# EAGLE design ThroughHoleModule-compact (EAGLE 7.7.0)
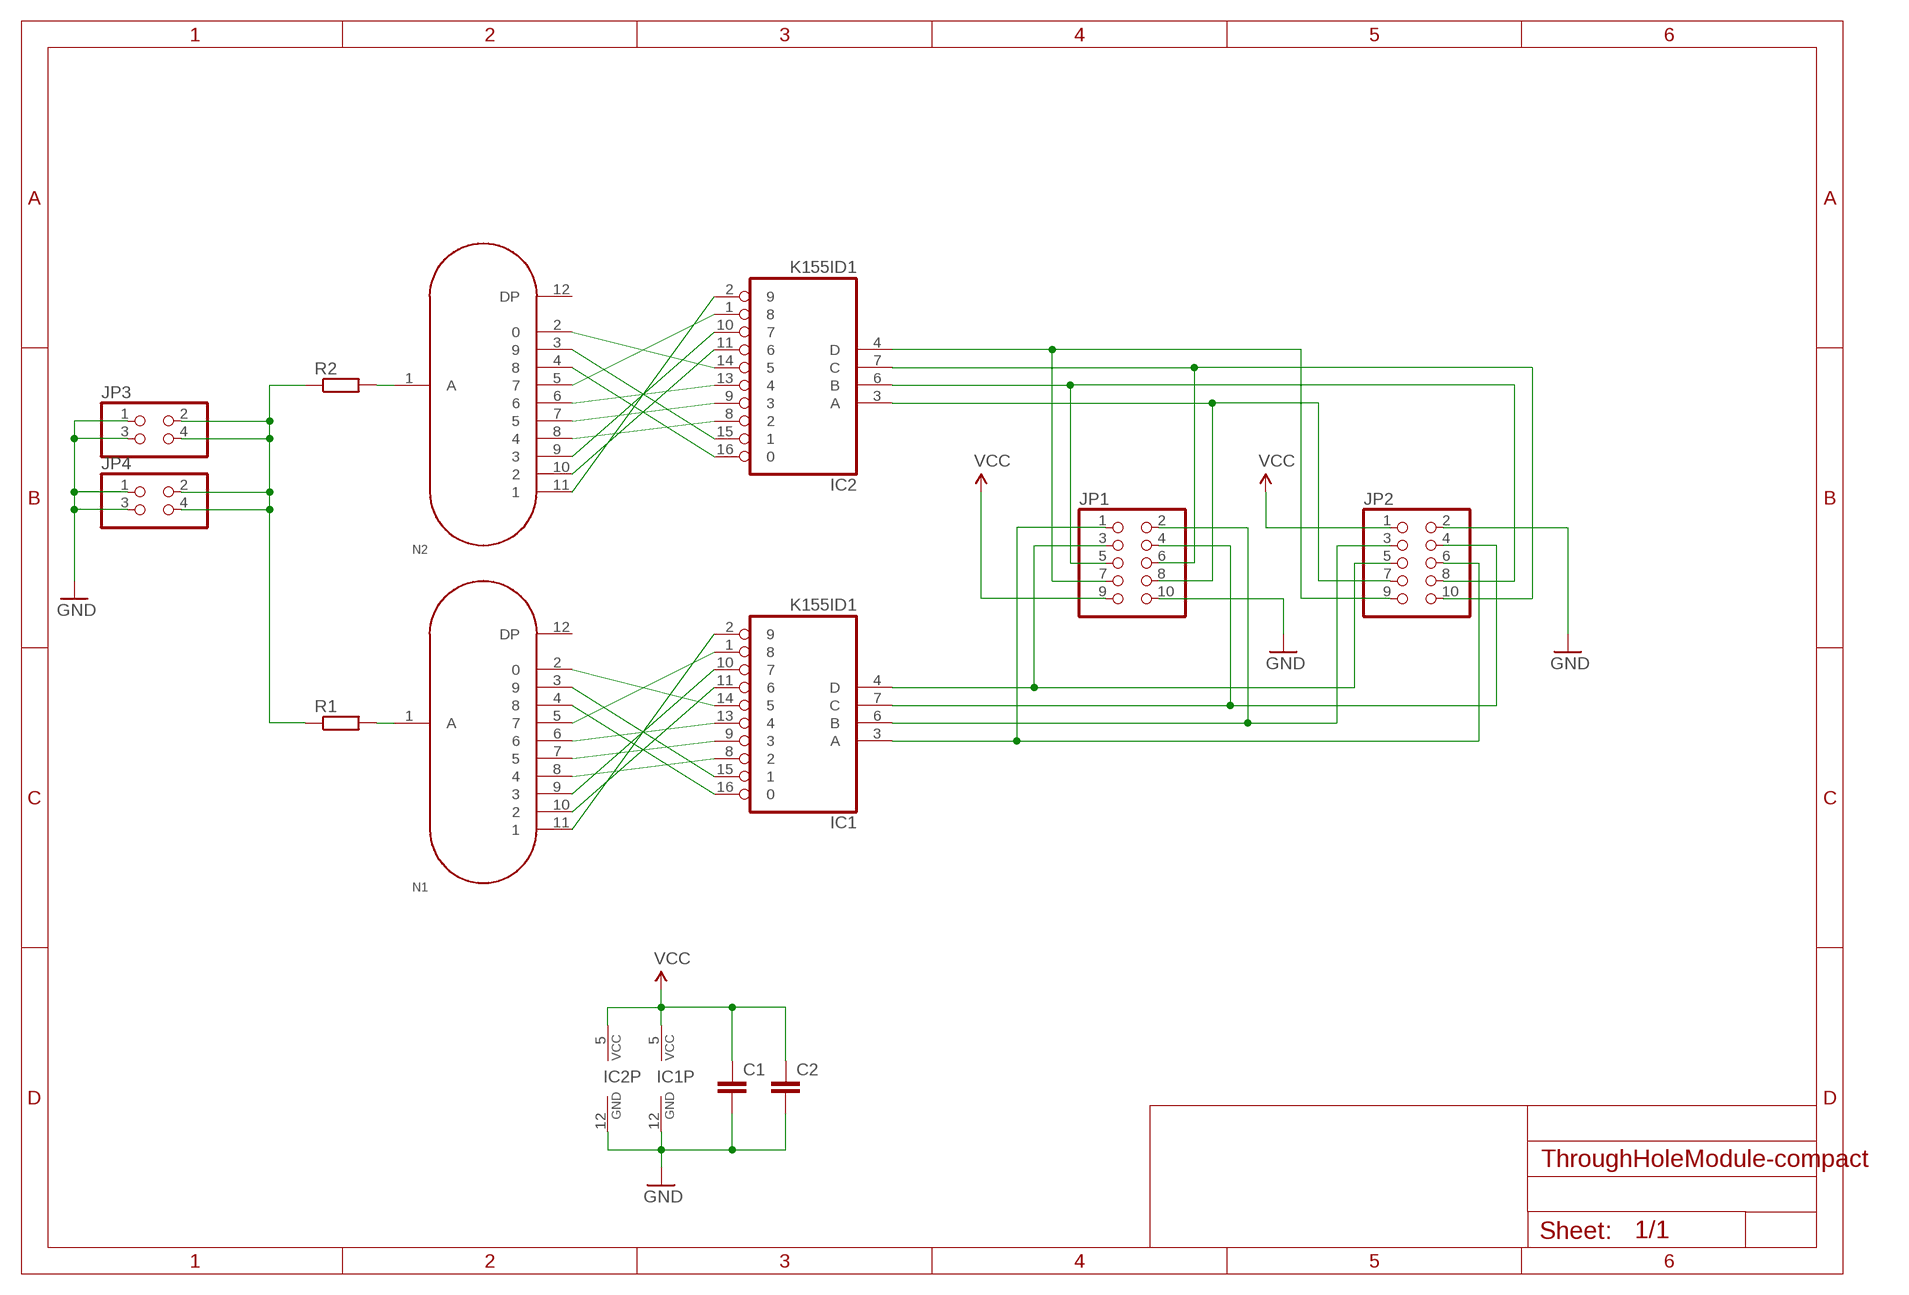
[diagram p0: schematic, sheet 1]

## Parts
C1  C-EU050-030X075  [C050-030X075]
C2  C-EU050-030X075  [C050-030X075]
IC1  K155ID1  74141N  [DIL16]
IC2  K155ID1  74141N  [DIL16]
JP1  PINHD-2X5  [2X05]
JP2  PINHD-2X5  [2X05]
JP3  PINHD-2X2  [2X02]
JP4  PINHD-2X2  [2X02]
N1  IN-12B  [IN-12]
N2  IN-12B  [IN-12]
R1  R-EU_0207/10  [0207/10]
R2  R-EU_0207/10  [0207/10]

## Nets
1A: IC1.3(A) JP1.1 JP2.6
1B: IC1.6(B) JP1.2 JP2.3
1C: IC1.7(C) JP1.4 JP2.4
1D: IC1.4(D) JP1.3 JP2.5
2A: IC2.3(A) JP1.8 JP2.7
2B: IC2.6(B) JP1.5 JP2.8
2C: IC2.7(C) JP1.6 JP2.10
2D: IC2.4(D) JP1.7 JP2.9
GND: C1.2 C2.2 IC1.12(GND) IC2.12(GND) JP1.10 JP2.2 JP3.1 JP3.3 JP4.1 JP4.3
HV [HighVoltage]: JP3.2 JP3.4 JP4.2 JP4.4 R1.1 R2.1
N$1: IC2.1 N2.5
N$2: IC2.13 N2.6
N$3: IC1.1 N1.5
N$4: IC1.13 N1.6
N$9: IC2.9 N2.7
N$10: IC2.8 N2.8
N$11: IC2.10 N2.9
N$12: IC2.11 N2.10
N$13: IC2.2 N2.11
N$16: IC2.14 N2.2
N$17: IC2.15 N2.3
N$18: IC2.16 N2.4
N$19: IC1.2 N1.11
N$20: IC1.11 N1.10
N$21: IC1.10 N1.9
N$22: IC1.8 N1.8
N$23: IC1.9 N1.7
N$26: IC1.16 N1.4
N$27: IC1.15 N1.3
N$28: IC1.14 N1.2
N$29 [HighVoltage]: N1.1(A) R1.2
N$30 [HighVoltage]: N2.1(A) R2.2
VCC: C1.1 C2.1 IC1.5(VCC) IC2.5(VCC) JP1.9 JP2.1
Unconnected: N1.12(DP) N2.12(DP)

## Library data of the parts
C1 C2 = rcl:C-EU: CAPACITOR, European symbol
IC1 IC2 = 74xx-eu:74*141: BCD to decimal DECODER/DRIVER
JP1 JP2 = pinhead:PINHD-2X5: PIN HEADER
JP3 JP4 = pinhead:PINHD-2X2: PIN HEADER
N1 N2 = ThroughHoleModule-compact:IN-12B
R1 R2 = rcl:R-EU_: RESISTOR, European symbol

## Net classes
1 HighVoltage: width 0.051 mm, clearance 0.305 mm

## Board
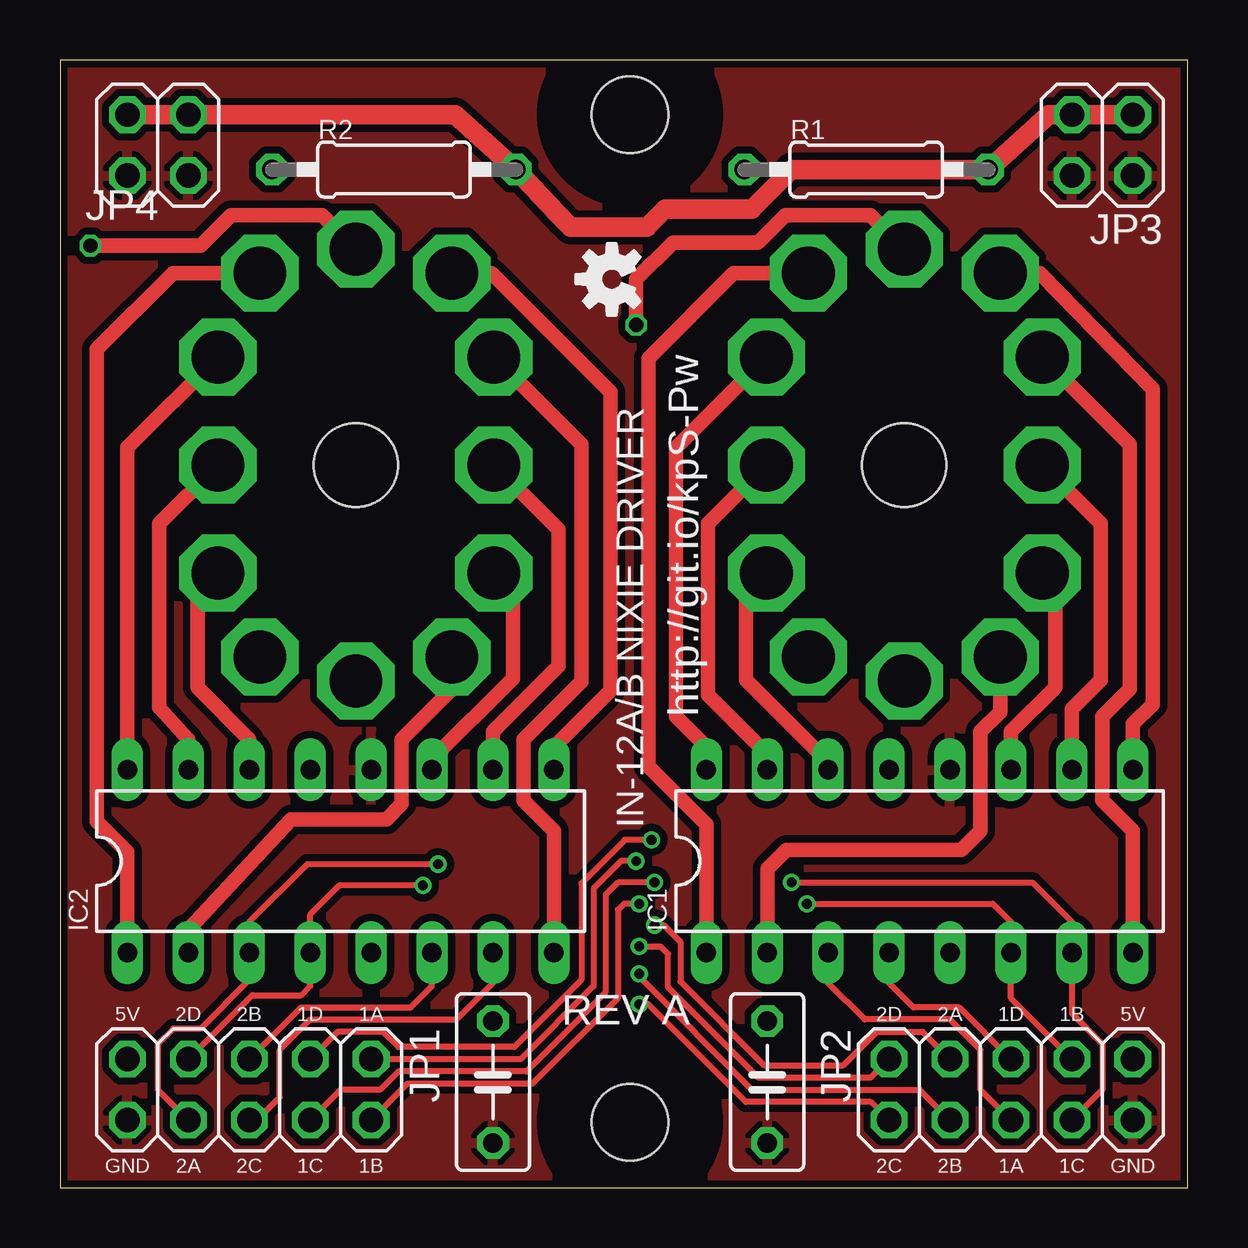
[diagram p1: board, top side]
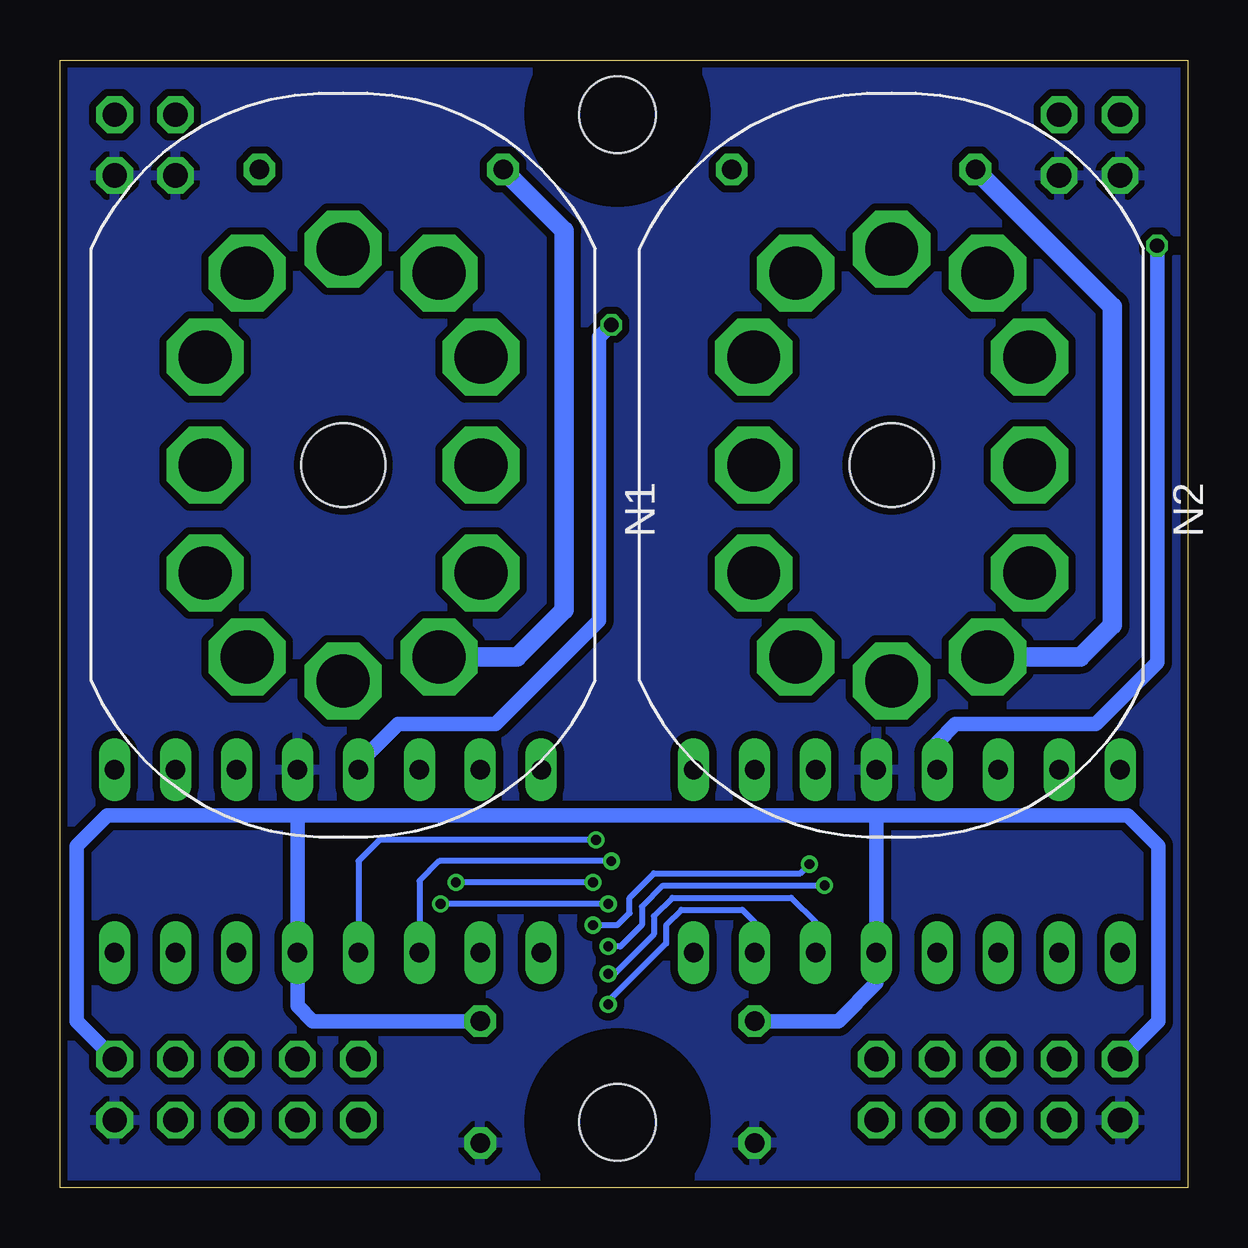
[diagram p2: board, bottom side, seen from below]

Size 47 x 47 mm. Coordinates in mm from the lower left corner, seen from the top.
Outline: 0,0 47,0 47,47 0,47 0,0
Copper layers (1*16): Top 0.035mm / dielectric 1.5mm / Bottom 0.035mm
Design rules "dirt_cheap_dirty_boards.v1.1": minimum track width 5mil, minimum drill 12mil, track to track 5mil, track to pad 5mil, pad to pad 5mil, via to via 5mil, smd to smd 0mil, copper to edge 10mil, drill to drill 10mil, minimum pad ring 10mil, minimum via ring 6mil, stop-mask expansion 2mil, vias tented up to drill 25mil, thermal gap 10mil
Holes 3.2 mm at 23.77,44.72 23.77,2.72
tRestrict: area 20.6,41.6 to 26.9,47.9; area 20.6,-0.4 to 26.9,5.9
bRestrict: area 20.6,41.6 to 26.9,47.9; area 20.6,-0.4 to 26.9,5.9

### Footprints (pad centres in the part's own frame; a part is rotated, then mirrored left to right if it is on the bottom)
C050-030X075 = drill 0.813 octagon: 1 -2.54,0; 2 2.54,0
DIL16 = drill 0.813 long: 1 -8.89,-3.81; 2 -6.35,-3.81; 3 -3.81,-3.81; 4 -1.27,-3.81; 5 1.27,-3.81; 6 3.81,-3.81; 7 6.35,-3.81; 8 8.89,-3.81; 9 8.89,3.81; 10 6.35,3.81; 11 3.81,3.81; 12 1.27,3.81; 13 -1.27,3.81; 14 -3.81,3.81; 15 -6.35,3.81; 16 -8.89,3.81
2X05 = drill 1.016 octagon: 1 -5.08,-1.27; 2 -5.08,1.27; 3 -2.54,-1.27; 4 -2.54,1.27; 5 0,-1.27; 6 0,1.27; 7 2.54,-1.27; 8 2.54,1.27; 9 5.08,-1.27; 10 5.08,1.27
2X02 = drill 1.016 octagon: 1 -1.27,-1.27; 2 -1.27,1.27; 3 1.27,-1.27; 4 1.27,1.27
IN-12 = drill 2.2 pad 3.1 octagon: 1 4,-8 | drill 2.2 octagon: 2 5.75,-4.5; 3 5.75,0; 4 5.75,4.5; 5 4,8; 6 0,9; 7 -4,8; 8 -5.75,4.5; 9 -5.75,0; 10 -5.75,-4.5; 11 -4,-8; 12 0,-9 | hole 3.5: 0,0
0207/10 = drill 0.813 octagon: 1 -5.08,0; 2 5.08,0

### Placement (x,y rotation side)
C1  29.48,4.4 270 top
C2  18.05,4.4 270 top
IC1  35.83,13.61 0 top
IC2  11.7,13.61 0 top
JP1  7.89,4.08 180 top
JP2  39.64,4.08 180 top
JP3  43.45,43.45 0 top
JP4  4.08,43.45 0 top
N1  35.2,30.11 0 bottom
N2  12.34,30.11 0 bottom
R1  33.61,42.43 180 top
R2  13.92,42.43 180 top
U$1  [OSHW-LOGO-S]  23,37.86 90 top

### Tracks (layer width: path | path; a pad name or v marks a point on that pad's centre or on a via)
1A  (via drill 0.41)
  Top 0.254: JP2.6 38.37,4.08 38.37,5.73 37.1,7 33.54,7 32.02,8.53 IC1.3 | v24.02,13.61 23.38,13.61 22.24,12.46 22.24,8.4 19.19,5.35 JP1.1
  Bottom 0.254: IC1.3 32.02,12.78 31.19,13.61 v24.02,13.61
1B  (via drill 0.41)
  Top 0.254: JP2.3 39.64,7.89 IC1.6 39.64,11.06 38.88,11.83 v31.13,11.83 | v24.15,11.83 23.51,11.83 23.26,11.57 23.26,7.89 19.7,4.33 14.49,4.33 JP1.2
  Bottom 0.254: v24.15,11.83 v31.13,11.83
1C  (via drill 0.41)
  Top 0.254: JP2.4 43.45,4.08 43.45,5.99 42.18,7.26 IC1.7 42.18,11.06 40.53,12.72 v30.5,12.72 | v24.78,12.72 23.26,12.72 22.75,12.21 22.75,8.14 19.45,4.84 14.11,4.84 13.35,4.08 11.7,4.08 JP1.4
  Bottom 0.254: v24.78,12.72 v30.5,12.72
1D  (via drill 0.41)
  Top 0.254: IC1.4 34.56,8.53 35.58,7.51 37.48,7.51 JP2.5 | v24.65,14.49 23.54,14.49 21.73,12.68 21.73,8.65 18.94,5.86 14.11,5.86 13.48,6.49 11.57,6.49 JP1.3
  Bottom 0.254: IC1.4 34.56,13.61 33.67,14.49 v24.65,14.49
2A  (via drill 0.41)
  Top 0.254: JP1.8 4.08,4.08 4.08,5.99 4.71,6.62 5.86,6.62 7.89,8.65 IC2.3 7.89,11.06 10.3,13.48 v15.76,13.48 | v24.78,10.94 25.16,10.94 25.86,10.24 25.86,8.59 29.35,5.1 32.66,5.1 34.05,6.49 35.96,6.49 JP2.7
  Bottom 0.254: v15.76,13.48 16.14,13.1 22.24,13.1 23.26,12.08 23.26,11.45 23.77,10.94 v24.78,10.94
2B  (via drill 0.41)
  Top 0.254: JP2.8 35.83,4.08 28.84,4.08 24.15,8.78 v24.15,8.91 | JP1.5 10.05,7.51 14.62,7.51 15.51,8.4 IC2.6
  Bottom 0.254: IC2.6 15.51,11.06 16.53,12.08 21.48,12.08 22.24,11.32 22.24,10.56 23.89,8.91 v24.15,8.91
2C  (via drill 0.41)
  Top 0.254: JP1.6 8.21,2.81 9.16,3.76 9.16,5.73 10.43,7 16.53,7 18.05,8.53 IC2.7 | v24.15,7.64 24.53,7.64 28.59,3.57 33.8,3.57 JP2.10
  Bottom 0.254: IC2.7 18.05,11.06 18.56,11.57 21.1,11.57 21.73,10.94 21.73,10.18 24.15,7.76 v24.15,7.64
2D  (via drill 0.41)
  Top 0.254: JP1.7 8.02,8.02 10.05,8.02 10.43,8.4 IC2.4 10.43,11.38 11.64,12.59 v15.13,12.59 | 34.24,5.03 JP2.9 33.8,4.59 29.1,4.59 25.35,8.34 25.35,9.73 25.04,10.05 v24.15,10.05
  Bottom 0.254: v15.13,12.59 21.86,12.59 22.75,11.7 22.75,10.94 23.64,10.05 v24.15,10.05
GND
  pour Top (isolate 0.305): 48.53,-1 -1,-1 -1,48.53 48.53,48.53
  pour Bottom (isolate 0.305): -1,-1 -1,48.53 48.53,48.53 48.53,-1
HV
  Top 0.813: JP3.4 JP3.2 41.23,44.72 R1.1 30.5,42.43 28.84,40.78 25.23,40.78 24.46,40.02 21.29,40.02 21.1,40.21 R2.1 16.46,44.72 JP4.4 JP4.2
N$1
  Top 0.61: IC2.1 2.81,13.99 1.54,15.26 1.54,34.94 4.71,38.12 N2.5
N$2  (via drill 0.6)
  Top 0.61: v1.27,39.26 5.86,39.26 7.13,40.53 10.92,40.53 N2.6
  Bottom 0.61: IC2.13 10.43,18.56 9.67,19.32 3.83,19.32 1.27,21.88 v1.27,39.26
N$3
  Top 0.61: IC1.1 26.94,15.13 24.53,17.54 24.53,34.56 28.08,38.12 N1.5
N$4  (via drill 0.6)
  Top 0.61: 24.02,36.21 v24.02,35.96 24.02,37.86 25.54,39.39 29.1,39.39 30.24,40.53 33.78,40.53 N1.6
  Bottom 0.61: IC1.13 34.56,17.67 32.91,19.32 28.84,19.32 24.53,23.64 24.53,35.45 v24.02,35.96
N$9
  Top 0.61: IC2.9 20.59,18.37 22.94,20.72 22.94,33.16 17.99,38.12 N2.7
N$10
  Top 0.61: IC2.8 20.59,14.88 19.32,16.14 19.32,18.68 21.73,21.1 21.73,30.97 N2.8
N$11
  Top 0.61: IC2.10 18.05,19 20.78,21.73 20.78,27.42 N2.9
N$12
  Top 0.61: IC2.11 15.51,17.86 18.88,21.23 18.88,24.82 N2.10
N$13
  Top 0.61: N2.11 16.34,20.78 14.24,18.68 14.24,15.99 13.61,15.35 9.64,15.35 5.35,10.75 IC2.2
N$16
  Top 0.61: IC2.14 7.89,18.68 5.73,20.84 5.73,24.76 N2.2
N$17
  Top 0.61: IC2.15 5.35,18.68 4.14,20.02 4.14,27.67 N2.3
N$18
  Top 0.61: IC2.16 2.81,30.84 N2.4
N$19
  Top 0.61: IC1.2 29.48,13.29 30.27,14.08 37.58,14.08 38.37,14.88 38.37,19 39.2,19.83 N1.11
N$20
  Top 0.61: IC1.11 39.64,19 41.48,20.84 41.48,25.08 N1.10
N$21
  Top 0.61: IC1.10 42.18,19.95 43.39,21.16 43.39,27.67 N1.9
N$22
  Top 0.61: IC1.8 44.72,14.88 43.45,16.14 43.45,19.64 44.59,20.78 44.59,30.97 N1.8
N$23
  Top 0.61: IC1.9 44.72,19.32 45.55,20.14 45.55,33.29 40.85,38.12 N1.7
N$26
  Top 0.61: IC1.16 26.94,18.37 25.67,19.64 25.67,30.84 N1.4
N$27
  Top 0.61: IC1.15 29.48,18.05 27,20.53 27,27.67 N1.3
N$28
  Top 0.61: IC1.14 32.02,17.73 28.59,21.16 28.59,24.76 N1.2
N$29
  Bottom 0.813: N1.1 27.95,22.11 25.99,24.08 25.99,39.89 R1.2
N$30
  Bottom 0.813: R2.2 3.13,36.72 3.13,23.45 4.46,22.11 N2.1
VCC
  Bottom 0.61: JP1.9 1.22,6.94 1.22,14.24 2.49,15.51 12.97,15.51 | 12.97,15.51 37.1,15.51 | 12.97,15.51 IC2.5 12.97,8.53 14.56,6.94 C2.1 | C1.1 36.47,6.94 37.1,7.57 IC1.5 37.1,15.51 | JP2.1 46.31,6.94 46.31,14.24 45.04,15.51 37.1,15.51

### Text on the board
tPlace: 5V | 2D | 2B | 1D | 1A | 2D | 2A | 1D | 1B | 5V | GND | 2A | 2C | 1C | 1B | 2C | 2B | 1A | 1C | GND
tNames: IN-12A/B NIXIE DRIVER | http://git.io/kpS-Pw | REV A